# Altium project LimeSDR-QPCIe_1v2.PrjPcb (part 3 of 13)

## Sheet 09_RF_Loopback.SchDoc: Loopback
size A3; Organization: Lime Microsystems; Address1: Surrey Tech Centre; Address2: Guildford GU2 7YG; Address3: Surrey; Address4: United Kingdom; Revision: v1.2; SheetNumber: 9; SheetTotal: 27
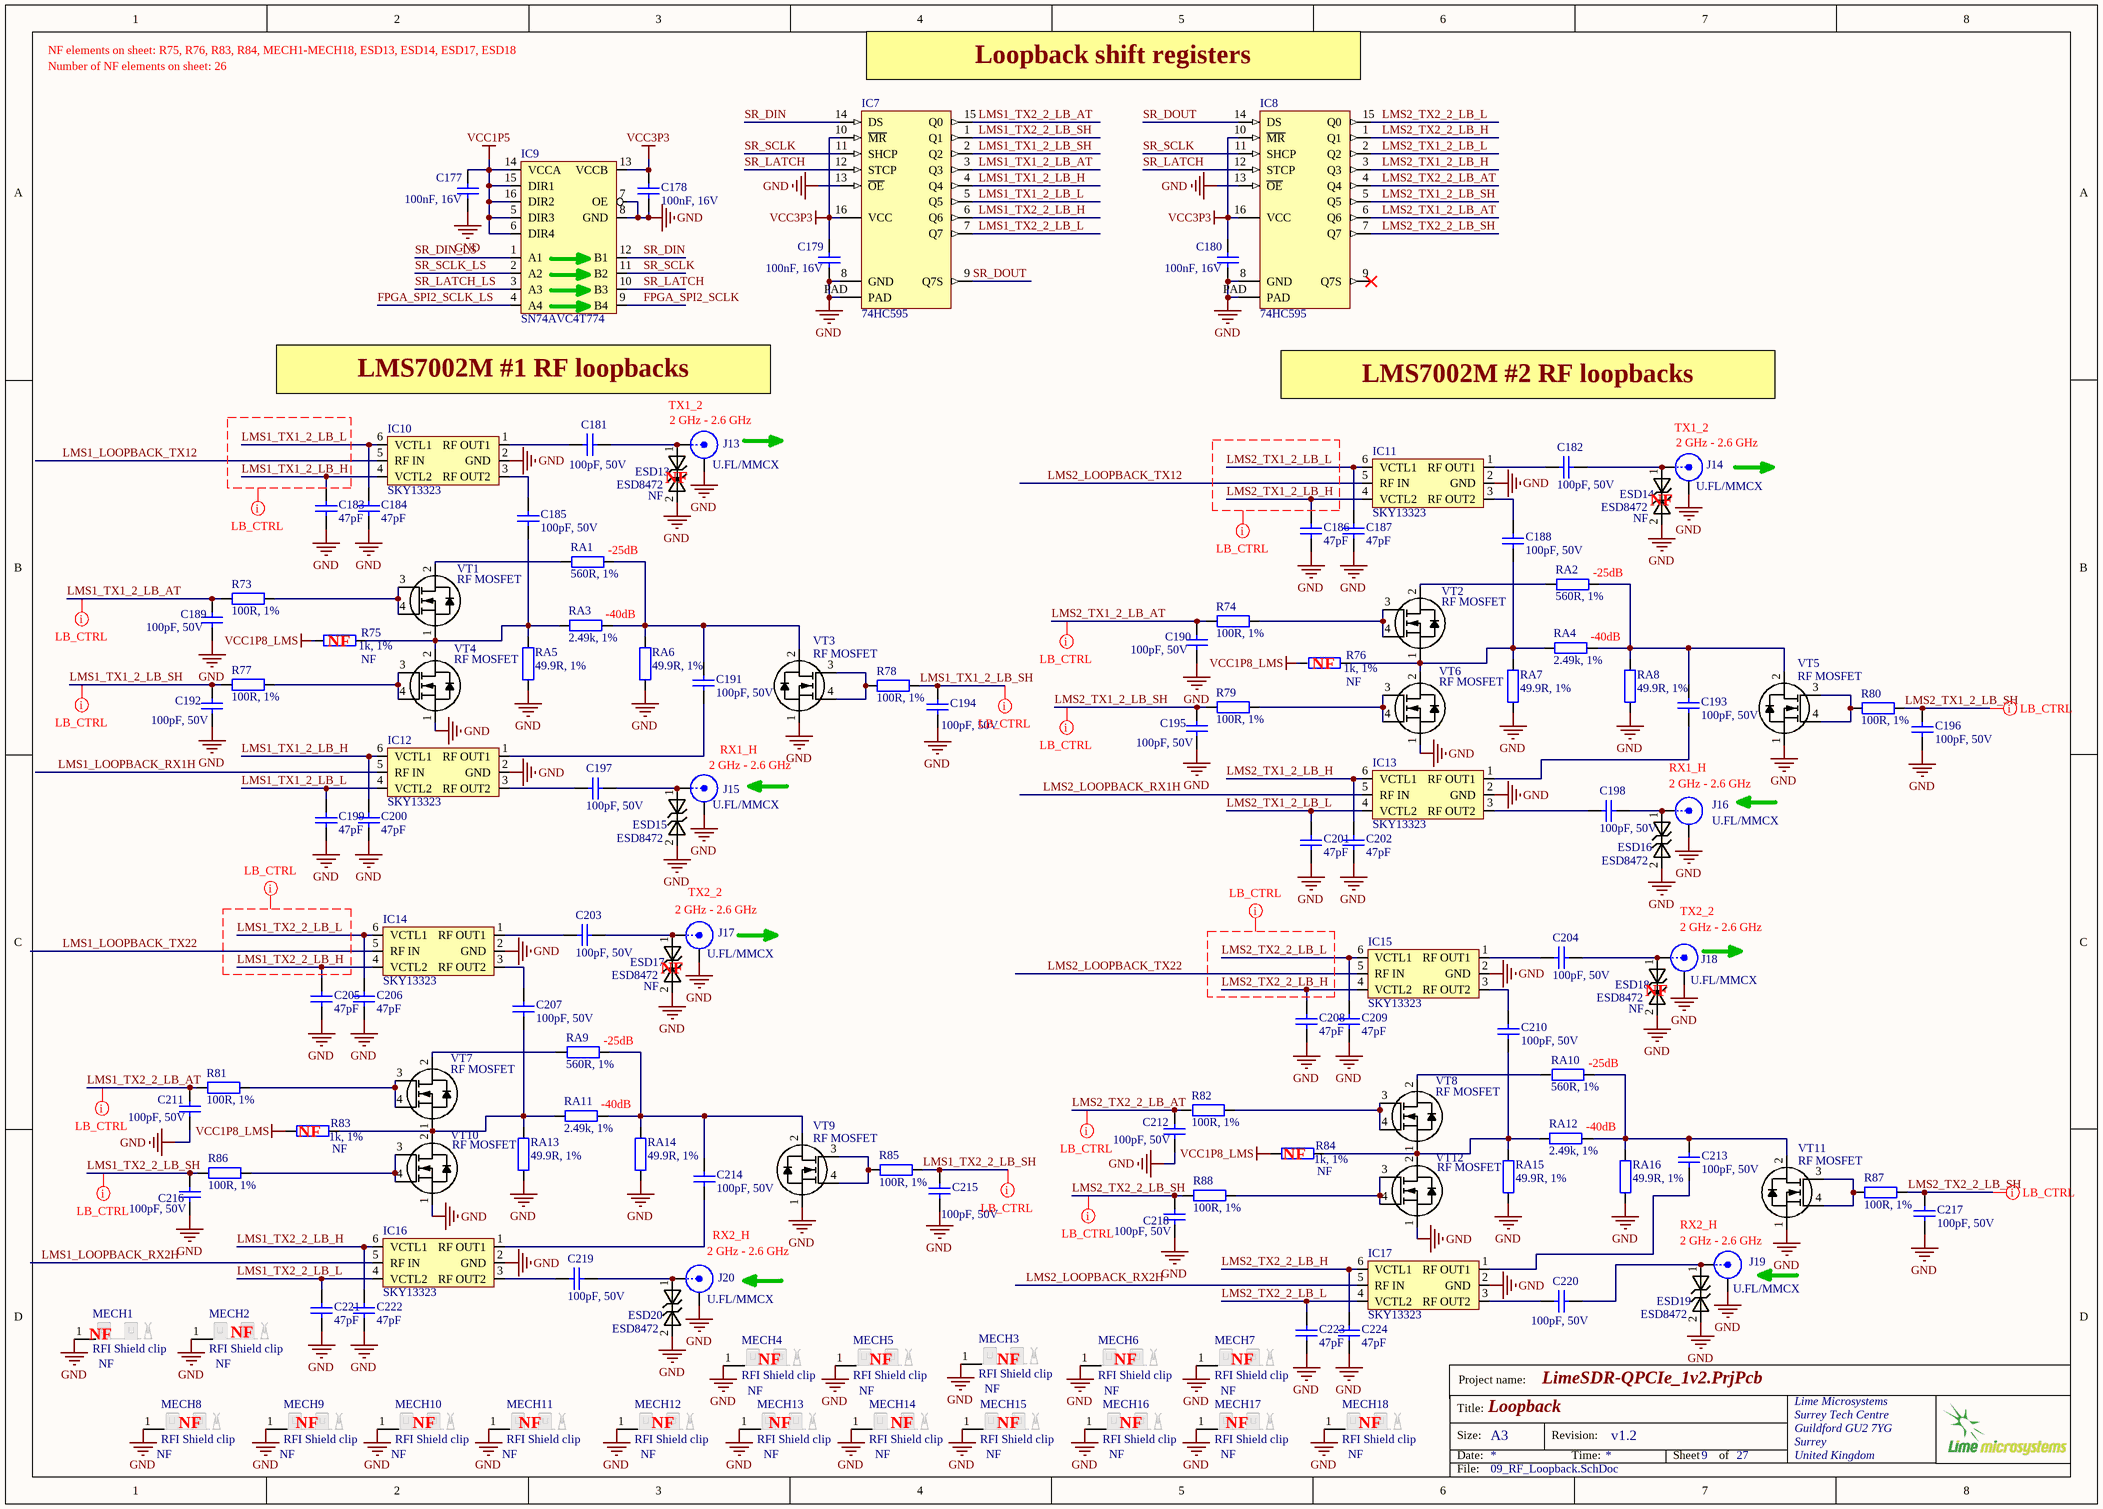
[diagram p8: 09_RF_Loopback.SchDoc]

### Parts
C177  100nF, 16V  [CAP0402]
C178  100nF, 16V  [CAP0402]
C179  100nF, 16V  [CAP0402]
C180  100nF, 16V  [CAP0402]
C181  100pF, 50V  [CAP0402]
C182  100pF, 50V  [CAP0402]
C183  47pF  [CAP0402]
C184  47pF  [CAP0402]
C185  100pF, 50V  [CAP0402]
C186  47pF  [CAP0402]
C187  47pF  [CAP0402]
C188  100pF, 50V  [CAP0402]
C189  100pF, 50V  [CAP0402]
C190  100pF, 50V  [CAP0402]
C191  100pF, 50V  [CAP0402]
C192  100pF, 50V  [CAP0402]
C193  100pF, 50V  [CAP0402]
C194  100pF, 50V  [CAP0402]
C195  100pF, 50V  [CAP0402]
C196  100pF, 50V  [CAP0402]
C197  100pF, 50V  [CAP0402]
C198  100pF, 50V  [CAP0402]
C199  47pF  [CAP0402]
C200  47pF  [CAP0402]
C201  47pF  [CAP0402]
C202  47pF  [CAP0402]
C203  100pF, 50V  [CAP0402]
C204  100pF, 50V  [CAP0402]
C205  47pF  [CAP0402]
C206  47pF  [CAP0402]
C207  100pF, 50V  [CAP0402]
C208  47pF  [CAP0402]
C209  47pF  [CAP0402]
C210  100pF, 50V  [CAP0402]
C211  100pF, 50V  [CAP0402]
C212  100pF, 50V  [CAP0402]
C213  100pF, 50V  [CAP0402]
C214  100pF, 50V  [CAP0402]
C215  100pF, 50V  [CAP0402]
C216  100pF, 50V  [CAP0402]
C217  100pF, 50V  [CAP0402]
C218  100pF, 50V  [CAP0402]
C219  100pF, 50V  [CAP0402]
C220  100pF, 50V  [CAP0402]
C221  47pF  [CAP0402]
C222  47pF  [CAP0402]
C223  47pF  [CAP0402]
C224  47pF  [CAP0402]
ESD13  ESD8472  Assembly Info: NF  [ESD8472_X3DFN2]
ESD14  ESD8472  Assembly Info: NF  [ESD8472_X3DFN2]
ESD15  ESD8472  [ESD8472_X3DFN2]
ESD16  ESD8472  [ESD8472_X3DFN2]
ESD17  ESD8472  Assembly Info: NF  [ESD8472_X3DFN2]
ESD18  ESD8472  Assembly Info: NF  [ESD8472_X3DFN2]
ESD19  ESD8472  [ESD8472_X3DFN2]
ESD20  ESD8472  [ESD8472_X3DFN2]
IC7  74HC595  [74HC595BQ,115]
IC8  74HC595  [74HC595BQ,115]
IC9  SN74AVC4T774  [SN74AVC4T774]
IC10  SKY13323  [SKY13323-378LF]
IC11  SKY13323  [SKY13323-378LF]
IC12  SKY13323  [SKY13323-378LF]
IC13  SKY13323  [SKY13323-378LF]
IC14  SKY13323  [SKY13323-378LF]
IC15  SKY13323  [SKY13323-378LF]
IC16  SKY13323  [SKY13323-378LF]
IC17  SKY13323  [SKY13323-378LF]
J13  U.FL/MMCX  [MMCX_UFL_conn_u]
J14  U.FL/MMCX  [MMCX_UFL_conn_u]
J15  U.FL/MMCX  [MMCX_UFL_conn_u]
J16  U.FL/MMCX  [MMCX_UFL_conn_u]
J17  U.FL/MMCX  [MMCX_UFL_conn_u]
J18  U.FL/MMCX  [MMCX_UFL_conn_u]
J19  U.FL/MMCX  [MMCX_UFL_conn_u]
J20  U.FL/MMCX  [MMCX_UFL_conn_u]
MECH1  RFI Shield clip  Assembly Info: NF  [RFI_SHIELD_CLPS_MINI]
MECH2  RFI Shield clip  Assembly Info: NF  [RFI_SHIELD_CLPS_MINI]
MECH3  RFI Shield clip  Assembly Info: NF  [RFI_SHIELD_CLPS_MINI]
MECH4  RFI Shield clip  Assembly Info: NF  [RFI_SHIELD_CLPS_MINI]
MECH5  RFI Shield clip  Assembly Info: NF  [RFI_SHIELD_CLPS_MINI]
MECH6  RFI Shield clip  Assembly Info: NF  [RFI_SHIELD_CLPS_MINI]
MECH7  RFI Shield clip  Assembly Info: NF  [RFI_SHIELD_CLPS_MINI]
MECH8  RFI Shield clip  Assembly Info: NF  [RFI_SHIELD_CLPS_MINI]
MECH9  RFI Shield clip  Assembly Info: NF  [RFI_SHIELD_CLPS_MINI]
MECH10  RFI Shield clip  Assembly Info: NF  [RFI_SHIELD_CLPS_MINI]
MECH11  RFI Shield clip  Assembly Info: NF  [RFI_SHIELD_CLPS_MINI]
MECH12  RFI Shield clip  Assembly Info: NF  [RFI_SHIELD_CLPS_MINI]
MECH13  RFI Shield clip  Assembly Info: NF  [RFI_SHIELD_CLPS_MINI]
MECH14  RFI Shield clip  Assembly Info: NF  [RFI_SHIELD_CLPS_MINI]
MECH15  RFI Shield clip  Assembly Info: NF  [RFI_SHIELD_CLPS_MINI]
MECH16  RFI Shield clip  Assembly Info: NF  [RFI_SHIELD_CLPS_MINI]
MECH17  RFI Shield clip  Assembly Info: NF  [RFI_SHIELD_CLPS_MINI]
MECH18  RFI Shield clip  Assembly Info: NF  [RFI_SHIELD_CLPS_MINI]
R73  100R, 1%  [RES0402]
R74  100R, 1%  [RES0402]
R75  1k, 1%  Assembly Info: NF  [RES0402]
R76  1k, 1%  Assembly Info: NF  [RES0402]
R77  100R, 1%  [RES0402]
R78  100R, 1%  [RES0402]
R79  100R, 1%  [RES0402]
R80  100R, 1%  [RES0402]
R81  100R, 1%  [RES0402]
R82  100R, 1%  [RES0402]
R83  1k, 1%  Assembly Info: NF  [RES0402]
R84  1k, 1%  Assembly Info: NF  [RES0402]
R85  100R, 1%  [RES0402]
R86  100R, 1%  [RES0402]
R87  100R, 1%  [RES0402]
R88  100R, 1%  [RES0402]
RA1  560R, 1%  [RES0402]
RA2  560R, 1%  [RES0402]
RA3  2.49k, 1%  [RES0402]
RA4  2.49k, 1%  [RES0402]
RA5  49.9R, 1%  [RES0402]
RA6  49.9R, 1%  [RES0402]
RA7  49.9R, 1%  [RES0402]
RA8  49.9R, 1%  [RES0402]
RA9  560R, 1%  [RES0402]
RA10  560R, 1%  [RES0402]
RA11  2.49k, 1%  [RES0402]
RA12  2.49k, 1%  [RES0402]
RA13  49.9R, 1%  [RES0402]
RA14  49.9R, 1%  [RES0402]
RA15  49.9R, 1%  [RES0402]
RA16  49.9R, 1%  [RES0402]
VT1  RF MOSFET  [BF1105R_SOT143R4]
VT2  RF MOSFET  [BF1105R_SOT143R4]
VT3  RF MOSFET  [BF1105R_SOT143R4]
VT4  RF MOSFET  [BF1105R_SOT143R4]
VT5  RF MOSFET  [BF1105R_SOT143R4]
VT6  RF MOSFET  [BF1105R_SOT143R4]
VT7  RF MOSFET  [BF1105R_SOT143R4]
VT8  RF MOSFET  [BF1105R_SOT143R4]
VT9  RF MOSFET  [BF1105R_SOT143R4]
VT10  RF MOSFET  [BF1105R_SOT143R4]
VT11  RF MOSFET  [BF1105R_SOT143R4]
VT12  RF MOSFET  [BF1105R_SOT143R4]

### Nets
GND: C177.1 C178.1 C179.1 C180.1 C183.1 C184.1 C186.1 C187.1 C189.2 C190.2 C192.2 C194.2 C195.2 C196.2 C199.1 C200.1 C201.1 C202.1 C205.1 C206.1 C208.1 C209.1 C211.2 C212.2 C215.2 C216.2 C217.2 C218.2 C221.1 C222.1 C223.1 C224.1 ESD13.2 ESD14.2 ESD15.2 ESD16.2 ESD17.2 ESD18.2 ESD19.2 ESD20.2 IC7.8(GND) IC7.13(~{OE}) IC7.PAD IC8.8(GND) IC8.13(~{OE}) IC8.PAD IC9.7(OE) IC9.8(GND) IC10.2(GND) IC11.2(GND) IC12.2(GND) IC13.2(GND) IC14.2(GND) IC15.2(GND) IC16.2(GND) IC17.2(GND) J13.2(Y) J14.2(Y) J15.2(Y) J16.2(Y) J17.2(Y) J18.2(Y) J19.2(Y) J20.2(Y) MECH1.1(GND) MECH2.1(GND) MECH3.1(GND) MECH4.1(GND) MECH5.1(GND) MECH6.1(GND) MECH7.1(GND) MECH8.1(GND) MECH9.1(GND) MECH10.1(GND) MECH11.1(GND) MECH12.1(GND) MECH13.1(GND) MECH14.1(GND) MECH15.1(GND) MECH16.1(GND) MECH17.1(GND) MECH18.1(GND) RA5.1 RA6.1 RA7.1 RA8.1 RA13.1 RA14.1 RA15.1 RA16.1 VT3.1(S) VT4.1(S) VT5.1(S) VT6.1(S) VT9.1(S) VT10.1(S) VT11.1(S) VT12.1(S)
VCC1P5: C177.2 IC9.5(DIR3) IC9.6(DIR4) IC9.14(VCCA) IC9.15(DIR1) IC9.16(DIR2)
VCC1P8_LMS: R75.2 R76.2 R83.2 R84.2
VCC3P3: C178.2 C179.2 C180.2 IC7.10(~{MR}) IC7.16(VCC) IC8.10(~{MR}) IC8.16(VCC) IC9.13(VCCB)
FPGA_SPI2_SCLK: IC9.9(B4)
FPGA_SPI2_SCLK_LS: IC9.4(A4)
LMS1_LOOPBACK_RX1H: IC12.5(RF_IN)
LMS1_LOOPBACK_RX2H: IC16.5(RF_IN)
LMS1_LOOPBACK_TX12: IC10.5(RF_IN)
LMS1_LOOPBACK_TX22: IC14.5(RF_IN)
LMS1_TX1_2_LB_AT: C189.1 IC7.3(Q3) R73.2
LMS1_TX1_2_LB_H: C183.2 C200.2 IC7.4(Q4) IC10.4(VCTL2) IC12.6(VCTL1)
LMS1_TX1_2_LB_L: C184.2 C199.2 IC7.5(Q5) IC10.6(VCTL1) IC12.4(VCTL2)
LMS1_TX1_2_LB_SH: C192.1 C194.1 IC7.2(Q2) R77.2 R78.1
LMS1_TX2_2_LB_AT: C211.1 IC7.15(Q0) R81.2
LMS1_TX2_2_LB_H: C205.2 C222.2 IC7.6(Q6) IC14.4(VCTL2) IC16.6(VCTL1)
LMS1_TX2_2_LB_L: C206.2 C221.2 IC7.7(Q7) IC14.6(VCTL1) IC16.4(VCTL2)
LMS1_TX2_2_LB_SH: C215.1 C216.1 IC7.1(Q1) R85.1 R86.2
LMS2_LOOPBACK_RX1H: IC13.5(RF_IN)
LMS2_LOOPBACK_RX2H: IC17.5(RF_IN)
LMS2_LOOPBACK_TX12: IC11.5(RF_IN)
LMS2_LOOPBACK_TX22: IC15.5(RF_IN)
LMS2_TX1_2_LB_AT: C190.1 IC8.6(Q6) R74.2
LMS2_TX1_2_LB_H: C186.2 C202.2 IC8.3(Q3) IC11.4(VCTL2) IC13.6(VCTL1)
LMS2_TX1_2_LB_L: C187.2 C201.2 IC8.2(Q2) IC11.6(VCTL1) IC13.4(VCTL2)
LMS2_TX1_2_LB_SH: C195.1 C196.1 IC8.5(Q5) R79.2 R80.1
LMS2_TX2_2_LB_AT: C212.1 IC8.4(Q4) R82.2
LMS2_TX2_2_LB_H: C208.2 C224.2 IC8.1(Q1) IC15.4(VCTL2) IC17.6(VCTL1)
LMS2_TX2_2_LB_L: C209.2 C223.2 IC8.15(Q0) IC15.6(VCTL1) IC17.4(VCTL2)
LMS2_TX2_2_LB_SH: C217.1 C218.1 IC8.7(Q7) R87.1 R88.2
SR_DIN: IC7.14(DS) IC9.12(B1)
SR_DIN_LS: IC9.1(A1)
SR_DOUT: IC7.9(Q7S) IC8.14(DS)
SR_LATCH: IC7.12(STCP) IC8.12(STCP) IC9.10(B3)
SR_LATCH_LS: IC9.3(A3)
SR_SCLK: IC7.11(SHCP) IC8.11(SHCP) IC9.11(B2)
SR_SCLK_LS: IC9.2(A2)
NetC181_1: C181.1 ESD13.1 J13.1(X)
NetC181_2: C181.2 IC10.1(RF_OUT1)
NetC182_1: C182.1 ESD14.1 J14.1(X)
NetC182_2: C182.2 IC11.1(RF_OUT1)
NetC185_1: C185.1 IC10.3(RF_OUT2)
NetC185_2: C185.2 R75.1 RA3.1 RA5.2 VT1.1(S) VT4.2(D)
NetC188_1: C188.1 IC11.3(RF_OUT2)
NetC188_2: C188.2 R76.1 RA4.1 RA7.2 VT2.1(S) VT6.2(D)
NetC191_1: C191.1 RA1.1 RA3.2 RA6.2 VT3.2(D)
NetC191_2: C191.2 IC12.1(RF_OUT1)
NetC193_1: C193.1 RA2.1 RA4.2 RA8.2 VT5.2(D)
NetC193_2: C193.2 IC13.1(RF_OUT1)
NetC197_1: C197.1 ESD15.1 J15.1(X)
NetC197_2: C197.2 IC12.3(RF_OUT2)
NetC198_1: C198.1 ESD16.1 J16.1(X)
NetC198_2: C198.2 IC13.3(RF_OUT2)
NetC203_1: C203.1 ESD17.1 J17.1(X)
NetC203_2: C203.2 IC14.1(RF_OUT1)
NetC204_1: C204.1 ESD18.1 J18.1(X)
NetC204_2: C204.2 IC15.1(RF_OUT1)
NetC207_1: C207.1 IC14.3(RF_OUT2)
NetC207_2: C207.2 R83.1 RA11.1 RA13.2 VT7.1(S) VT10.2(D)
NetC210_1: C210.1 IC15.3(RF_OUT2)
NetC210_2: C210.2 R84.1 RA12.1 RA15.2 VT8.1(S) VT12.2(D)
NetC213_1: C213.1 RA10.1 RA12.2 RA16.2 VT11.2(D)
NetC213_2: C213.2 IC17.1(RF_OUT1)
NetC214_1: C214.1 RA9.1 RA11.2 RA14.2 VT9.2(D)
NetC214_2: C214.2 IC16.1(RF_OUT1)
NetC219_1: C219.1 ESD20.1 J20.1(X)
NetC219_2: C219.2 IC16.3(RF_OUT2)
NetC220_1: C220.1 ESD19.1 J19.1(X)
NetC220_2: C220.2 IC17.3(RF_OUT2)
NetR73_1: R73.1 VT1.3(G2) VT1.4(G1)
NetR74_1: R74.1 VT2.3(G2) VT2.4(G1)
NetR77_1: R77.1 VT4.3(G2) VT4.4(G1)
NetR78_2: R78.2 VT3.3(G2) VT3.4(G1)
NetR79_1: R79.1 VT6.3(G2) VT6.4(G1)
NetR80_2: R80.2 VT5.3(G2) VT5.4(G1)
NetR81_1: R81.1 VT7.3(G2) VT7.4(G1)
NetR82_1: R82.1 VT8.3(G2) VT8.4(G1)
NetR85_2: R85.2 VT9.3(G2) VT9.4(G1)
NetR86_1: R86.1 VT10.3(G2) VT10.4(G1)
NetR87_2: R87.2 VT11.3(G2) VT11.4(G1)
NetR88_1: R88.1 VT12.3(G2) VT12.4(G1)
NetRA1_2: RA1.2 VT1.2(D)
NetRA2_2: RA2.2 VT2.2(D)
NetRA9_2: RA9.2 VT7.2(D)
NetRA10_2: RA10.2 VT8.2(D)

Not connected (* = marked no-connect by the designer): IC8 9(Q7S)*

### Layout directives
net class LB_CTRL: LMS1_TX1_2_LB_AT, LMS1_TX1_2_LB_H, LMS1_TX1_2_LB_L, LMS1_TX1_2_LB_SH, LMS1_TX2_2_LB_AT, LMS1_TX2_2_LB_H, LMS1_TX2_2_LB_L, LMS1_TX2_2_LB_SH, LMS2_TX1_2_LB_AT, LMS2_TX1_2_LB_H, LMS2_TX1_2_LB_L, LMS2_TX1_2_LB_SH, LMS2_TX2_2_LB_AT, LMS2_TX2_2_LB_H, LMS2_TX2_2_LB_L, LMS2_TX2_2_LB_SH

### Notes on the sheet
- NF elements on sheet: R75, R76, R83, R84, MECH1-MECH18, ESD13, ESD14, ESD17, ESD18
- Number of NF elements on sheet: 26
- Loopback shift registers
- LMS7002M #1 RF loopbacks
- TX1_2
- 2 GHz - 2.6 GHz
- LMS7002M #2 RF loopbacks
- (near J14) 2 GHz - 2.6 GHz
- (near ESD13) NF
- (near ESD14) NF
- (near RA1) -25dB
- (near RA2) -25dB
- (near R75) NF
- (near RA3) -40dB
- (near RA4) -40dB
- (near R76) NF
- (near J15) 2 GHz - 2.6 GHz
- RX1_H
- TX2_2
- (near ESD17) NF
- (near J18) 2 GHz - 2.6 GHz
- (near RA9) -25dB
- (near ESD18) NF
- (near RA11) -40dB
- (near RA10) -25dB
- (near R83) NF
- (near R84) NF
- (near RA12) -40dB
- (near J20) 2 GHz - 2.6 GHz
- RX2_H
- (near MECH1) NF
- (near MECH2) NF
- (near MECH4) NF
- (near MECH5) NF
- (near MECH3) NF
- (near MECH6) NF
- (near MECH7) NF
- (near MECH8) NF
- (near MECH9) NF
- (near MECH10) NF
- (near MECH11) NF
- (near MECH12) NF
- (near MECH13) NF
- (near MECH14) NF
- (near MECH15) NF
- (near MECH16) NF
- (near MECH17) NF
- (near MECH18) NF
- Project name:
- Title:
- Size:
- Date:
- A3
- Revision:
- Time:
- Sheet
- of
- File:

### Library data of the parts
C177-C180 = Cap_0402: Manufacturer: Murata Electronics; Manufacturer Part Number: GRM155R71C104KA88D; Part Description: 0.10µF ±10% 16V Ceramic Capacitor X7R 0402 (1005 Metric); Tolerance: 10 %; Type: General Purpose MLCC; Capacitance: 0.1 uF; Case Length: 1 mm; Dielectric: X7R; Case Height: 0.5 mm; Temperature Coefficient / Code: +/- 15 %; Value: 100nF, 16V; Supplier 1: Mouser; Supplier Part Number 1: 81-GRM155R71C104KA88; Case Code - in: 0402; RoHS: RoHS Compliant; Operating Temperature Range: - 55 C to + 125 C; Series: GRM; Termination Style: SMD/SMT; Package / Case: 0402 (1005 metric); Voltage Rating DC: 16 V; Maximum Operating Temperature: + 125 C; Case Code - mm: 1005; Minimum Operating Temperature: - 55 C; Product Category: Low & Medium Capacitance SMD Ceramic Chip Capacitors; Packaging: Reel; Product: General Type MLCCs; Category: Multilayer Ceramic Capacitors MLCC - SMD/SMT; Brand: Murata Electronics; Case Width: 0.5 mm; RoHS - Mouser: Y; Standard Pack Qty: 10000; Minimum Order Quantity: 1; Reeling: True; Manufacturer Part Number 1: GRM155R71C104KA88D
C181 C182 C185 C188-C198 C203 C204 C207 C210-C220 = Cap_0402: Manufacturer Part Number 1: CC0402JRNPO9BN101; Manufacturer: Yageo; Part Description: 100pF ±5% 50V C0G, NP0 Ceramic Capacitor -55°C ~ 125°C Surface Mount, MLCC 0402 (1005 Metric) 0.039" L x 0.020" W (1.00mm x 0.50mm); Tolerance: ±5%; Temperature Coefficient: C0G, NP0; Value: 100pF, 50V; Capacitance: 100pF; Thickness (Max): 0.022" (0.55mm); Size / Dimension: 0.039" L x 0.020" W (1.00mm x 0.50mm); RoHS: RoHS Compliant; Ratings: -; Package / Case: 0402 (1005 Metric); Mounting Type: Surface Mount, MLCC; Height - Seated (Max): -; Features: -; Lead Spacing: -; Voltage - Rated: 50V; Operating Temperature: -55°C ~ 125°C; Packaging: Cut Tape (CT); Applications: General Purpose; Lead Style: -; Supplier 1: Digi-Key; Category: Capacitors; Supplier Part Number 1: 311-1024-1-ND
C183 C184 C186 C187 C199-C202 C205 C206 C208 C209 C221-C224 = Cap_0402: Manufacturer Part Number 1: C1005C0G1H470F050BA; Manufacturer: TDK Corporation; Part Description: 47pF ±1% 50V C0G, NP0 Ceramic Capacitor -55°C ~ 125°C Surface Mount, MLCC 0402 (1005 Metric) 0.039" L x 0.020" W (1.00mm x 0.50mm); Voltage - Rated: 50V; Temperature Coefficient: C0G, NP0; Tolerance: ±1%; Value: 47pF; Supplier 1: Digi-Key; Supplier Part Number 1: 445-5361-1-ND; Package / Case: 0402 (1005 Metric); Lead Spacing: -; Ratings: -; Mounting Type: Surface Mount, MLCC; Operating Temperature: -55°C ~ 125°C; Thickness (Max): 0.022" (0.55mm); Capacitance: 47pF; Packaging: Cut Tape (CT); Features: -; Applications: General Purpose; Lead Style: -; Size / Dimension: 0.039" L x 0.020" W (1.00mm x 0.50mm); Height - Seated (Max): -; RoHS: RoHS Compliant; Category: Capacitors
ESD13-ESD20 = ESD8472: Manufacturer: ON Semiconductor; Manufacturer Part Number: ESD8472MUT5G; Part Description: TVS DIODE 5.3VWM 14VC X3DFN2; Voltage - Reverse Standoff (Typ): 5.3V (Max); Voltage - Breakdown (Min): 7V; Voltage - Clamping (Max) @ Ipp: 14V; Current - Peak Pulse (10/1000µs): 3A (8/20µs); Power Line Protection: No; Capacitance @ Frequency: 0.2pF @ 1MHz; Supplier 1: Digi-Key; RoHS: RoHS Compliant; Category: Circuit Protection; Stock 1: 2295; Pricing 1: 1=0.39, 10=0.315, 100=0.2142, 500=0.16068, 1000=0.12051 (USD); Packaging: Cut Tape (CT); Part Status: Active; Type: Zener; Power - Peak Pulse: -; Applications: Automotive, RF Antenna; Operating Temperature: -55°C ~ 150°C (TJ); Mounting Type: Surface Mount; Package / Case: 2-XFDFN; Supplier Device Package: 2-X3DFN (0.62x0.32); ComponentLink1URL: http://www.onsemi.com/pub/Collateral/ESD8472-D.PDF; ComponentLink1Description: http://www.onsemi.com/pub/Collateral/ESD8472-D.PDF; Supplier Part Number 1: ESD8472MUT5GOSCT-ND
IC7 IC8 = 74HC595BQ,115: Part Description: C 8BIT SHIFT REGISTER 16-DHVQFN; Manufacturer: Nexperia USA Inc.; Logic Type: Shift Register; Output Type: Tri-State; Number of Bits per Element: 8; Function: Serial to Parallel, Serial; Voltage - Supply: 2 V ~ 6 V; Supplier 1: Digi-Key; Manufacturer Part Number 1: 74HC595BQ,115; RoHS: RoHS Compliant; Category: Integrated Circuits (ICs); Stock 1: 15449; Pricing 1: 1=0.39, 10=0.32, 100=0.2175, 500=0.16316, 1000=0.12236 (USD); Packaging: Cut Tape (CT); Part Status: Active; Operating Temperature: -40°C ~ 125°C; Mounting Type: Surface Mount; Package / Case: 16-VFQFN Exposed Pad; Supplier Device Package: 16-DHVQFN (2.5x3.5); ComponentLink1URL: http://assets.nexperia.com/documents/data-sheet/74HC_HCT595.pdf; ComponentLink1Description: http://assets.nexperia.com/documents/data-sheet/74HC_HCT595.pdf; Supplier Part Number 1: 1727-3327-1-ND
IC9 = SN74AVC4T774: Manufacturer: Texas Instruments; Manufacturer Part Number 1: SN74AVC4T774RSVR; Part Description: Voltage Level Translator Bidirectional 1 Circuit 4 Channel 380Mbps 16-UQFN (2.6x1.8); Logic Function: Translator, Bidirectional, 3-State; Differential - Input:Output: No/No; Propagation Delay (Max): 2.4ns; Number of Bits: 4; Number of Outputs/Channel: 1; Input Type: Logic; Voltage - Supply: 1.2 V ~ 3.6 V; Data Rate: 380Mbps; Supplier 1: Digi-Key; Supplier Device Package: 16-UQFN (2.6x1.8); Packaging: Digi-Reel®; Category: Integrated Circuits (ICs); Mounting Type: Surface Mount; RoHS: RoHS Compliant; Number of Channels: 4; Output Type: Logic; Package / Case: 16-UFQFN; Operating Temperature: -40°C ~ 85°C; Supplier Part Number 1: 296-24741-6-ND
IC10-IC17 = SKY13323: SKY13323-378LF: 0.1-3.0 GHz GaAs SPDT Switch; Manufacturer: Skyworks Solutions Inc.; Part Description: IC SPDT 100MHZ-3GHZ 6-MLPD; Frequency - Lower: 100MHz; P1dB: 27dBm (typ) IP1dB; Isolation @ Frequency: 27dB @ 3GHz (typ); RF Type: 802.11b/g; Impedance: 50 Ohm; IIP3: 50dBm (typ); Topology: Reflective; Insertion Loss @ Frequency: 0.35dB @ 3GHz; Frequency - Upper: 3GHz; Supplier 1: Digi-Key; Operating Temperature: -40°C ~ 85°C; RoHS: RoHS Compliant; Package / Case: 6-XFDFN Exposed Pad; Circuit: SPDT; Features: -; Supplier Device Package: 6-MLPD (1x1); Category: RF/IF and RFID; Packaging: Cut Tape (CT); Manufacturer Part Number 1: SKY13323-378LF; Supplier Part Number 1: 683-1334-1-ND
J13-J20 = RF_IF_connector: CONN UMC RCPT STR 50 OHM SMD; Manufacturer: Molex, LLC; Manufacturer Part Number 1: 0734120110; Part Description: Ultra Miniature Coaxial Connector Receptacle, Male Pin 50 Ohm Surface Mount Solder; Body Finish: Nickel; Body Material: Phosphor Bronze; Center Contact Material: Brass; Center Contact Plating: Gold; Connector Style: Ultra Miniature Coaxial; Connector Type: Jack, Male Pin; Contact Termination: Solder; Dielectric Material: Liquid Crystal Polymer (LCP); Frequency - Max: 6GHz; Impedance: 50 Ohm; Voltage Rating: 60V; Cable Group: -; Category: Connectors, Interconnects; Fastening Type: Snap-On; Features: -; Housing Color: Silver; Ingress Protection: -; Mounting Type: Surface Mount; Operating Temperature: -40°C ~ 90°C; Packaging: Cut Tape (CT); RoHS: RoHS Compliant; Shield Termination: Solder; Supplier 1: Digi-Key; Supplier Part Number 1: WM5587CT-ND
MECH1-MECH18 = RFI_SHIELD_CLIP: Manufacturer: HARWIN; Part Description: RFI SHIELD CLIP MINI TIN SMD; Manufacturer Part Number 1: S0971-46R; SVHC: No SVHC (15-Jun-2015); Supplier 1: Farnell; Supplier: Farnell; Length: 5.8; Clip Type: RFI Shield Clip; Clip Diameter: -; Product Range: -; Mounting Hole Dia: -; RoHS: YES; Supplier Part Number 1: 2361677
R73 R74 R77-R82 R85-R88 = Res_0402: Manufacturer Part Number 1: RMCF0402FT100R; Part Description: RES SMD 100 OHM 1% 1/16W 0402; Manufacturer: Stackpole Electronics Inc.; Temperature Coefficient: ±100ppm/°C; Supplier 1: Digi-Key; Supplier Part Number 1: RMCF0402FT100RDKR-ND; Package / Case: 0402 (1005 Metric); Composition: Thick Film; Category: Resistors; Tolerance: ±1%; Value: 100R, 1%
R75 R76 R83 R84 = Res_0402: Manufacturer: Stackpole Electronics Inc; Manufacturer Part Number 1: RMCF0402FT1K00; Part Description: RES SMD 1K OHM 1% 1/16W 0402; Temperature Coefficient: ±100ppm/°C; Power (Watts): 0.063W, 1/16W; Value: 1k, 1%; Supplier 1: Digi-Key; Supplier Part Number 1: RMCF0402FT1K00TR-ND; Resistance (Ohms): 1k; Packaging: Tape & Reel (TR); Category: Resistors; RoHS: RoHS Compliant; Tolerance: ±1%; Height: 0.016" (0.40mm); Number of Terminations: 2; Package / Case: 0402 (1005 Metric); Operating Temperature: -55°C ~ 155°C; Features: -; Composition: Thick Film; Supplier Device Package: 0402; Size / Dimension: 0.039" L x 0.020" W (1.00mm x 0.50mm)
RA1 RA2 RA9 RA10 = Res_0402: Manufacturer Part Number: CRCW0402560RFKED; Manufacturer: Vishay Dale; Part Description: RES SMD 560 OHM 1% 1/16W 0402; Resistance (Ohms): 560; Power (Watts): 0.063W, 1/16W; Temperature Coefficient: ±100ppm/°C; RoHS: RoHS Compliant; Packaging: Cut Tape (CT); Composition: Thick Film; Tolerance: ±1%; Number of Terminations: 2; Supplier Device Package: 0402 (1005 Metric); Operating Temperature: -55°C ~ 155°C; Features: Automotive AEC-Q200; Category: Resistors; Supplier Part Number 1: 541-560LCT-ND; Package / Case: 0402 (1005 Metric); Supplier 1: Digi-Key; Height: 0.016" (0.40mm); Size / Dimension: 0.039" L x 0.020" W (1.00mm x 0.50mm)
RA3 RA4 RA11 RA12 = Res_0402: Manufacturer Part Number: RC0402FR-072K49L; Manufacturer: Yageo; Part Description: RES SMD 2.49K OHM 1% 1/16W 0402; Temperature Coefficient: ±100ppm/°C; Power (Watts): 0.063W, 1/16W; Value: 2.49k, 1%; Size / Dimension: 0.039" L x 0.020" W (1.00mm x 0.50mm); Height: 0.016" (0.40mm); Features: Moisture Resistant; Resistance (Ohms): 2.49k; Operating Temperature: -55°C ~ 155°C; Tolerance: ±1%; Composition: Thick Film; Supplier Device Package: 0402; Package / Case: 0402 (1005 Metric); Number of Terminations: 2; Category: Resistors; Packaging: Digi-Reel®; Supplier Part Number 1: 311-2.49KLRDKR-ND; RoHS: RoHS Compliant; Supplier 1: Digi-Key
RA5-RA8 RA13-RA16 = Res_0402: Manufacturer: Samsung Electro-Mechanics America, Inc.; Manufacturer Part Number: RC1005F49R9CS; Part Description: RES SMD 49.9 OHM 1% 1/16W 0402; Temperature Coefficient: ±100ppm/°C; Resistance (Ohms): 49.9; Power (Watts): 0.063W, 1/16W; Number of Terminations: 2; Size / Dimension: 0.039" L x 0.020" W (1.00mm x 0.50mm); Supplier Device Package: 0402 (1005 Metric); RoHS: RoHS Compliant; Supplier Part Number 1: 1276-3469-6-ND; Features: -; Packaging: Digi-Reel®; Tolerance: ±1%; Height: 0.016" (0.40mm); Category: Resistors; Composition: Thick Film; Package / Case: 0402 (1005 Metric); Supplier 1: Digi-Key; Operating Temperature: -55°C ~ 155°C; Value: 49.9R, 1%
VT1-VT12 = BF1105R,215: Manufacturer: NXP Semiconductors; Part Description: RF MOSFET Transistors Trans MOSFET N-CH 7V 0.03A 4pin(3+Tab); Voltage - Rated: 7V; Noise Figure: 1.7dB; Current Rating: 30mA; Gain: 20dB; Transistor Type: N-Channel Dual Gate; Frequency: 800MHz; Voltage - Test: 5V; Supplier 1: Digi-Key; RoHS: RoHS Compliant; Supplier Device Package: SOT-143R; Power - Output: -; Current - Test: -; Manufacturer Part Number 1: BF1105R,215; Packaging: Digi-Reel®; Package / Case: SOT-143R; Category: Discrete Semiconductor Products; Supplier Part Number 1: 568-12530-6-ND

## Sheet 10_RSSI1.SchDoc: RSSI1
size A3; Organization: Lime Microsystems; Address1: Surrey Tech Centre; Address2: Guildford GU2 7YG; Address3: Surrey; Address4: United Kingdom; Revision: v1.2; SheetNumber: 9; SheetTotal: 27
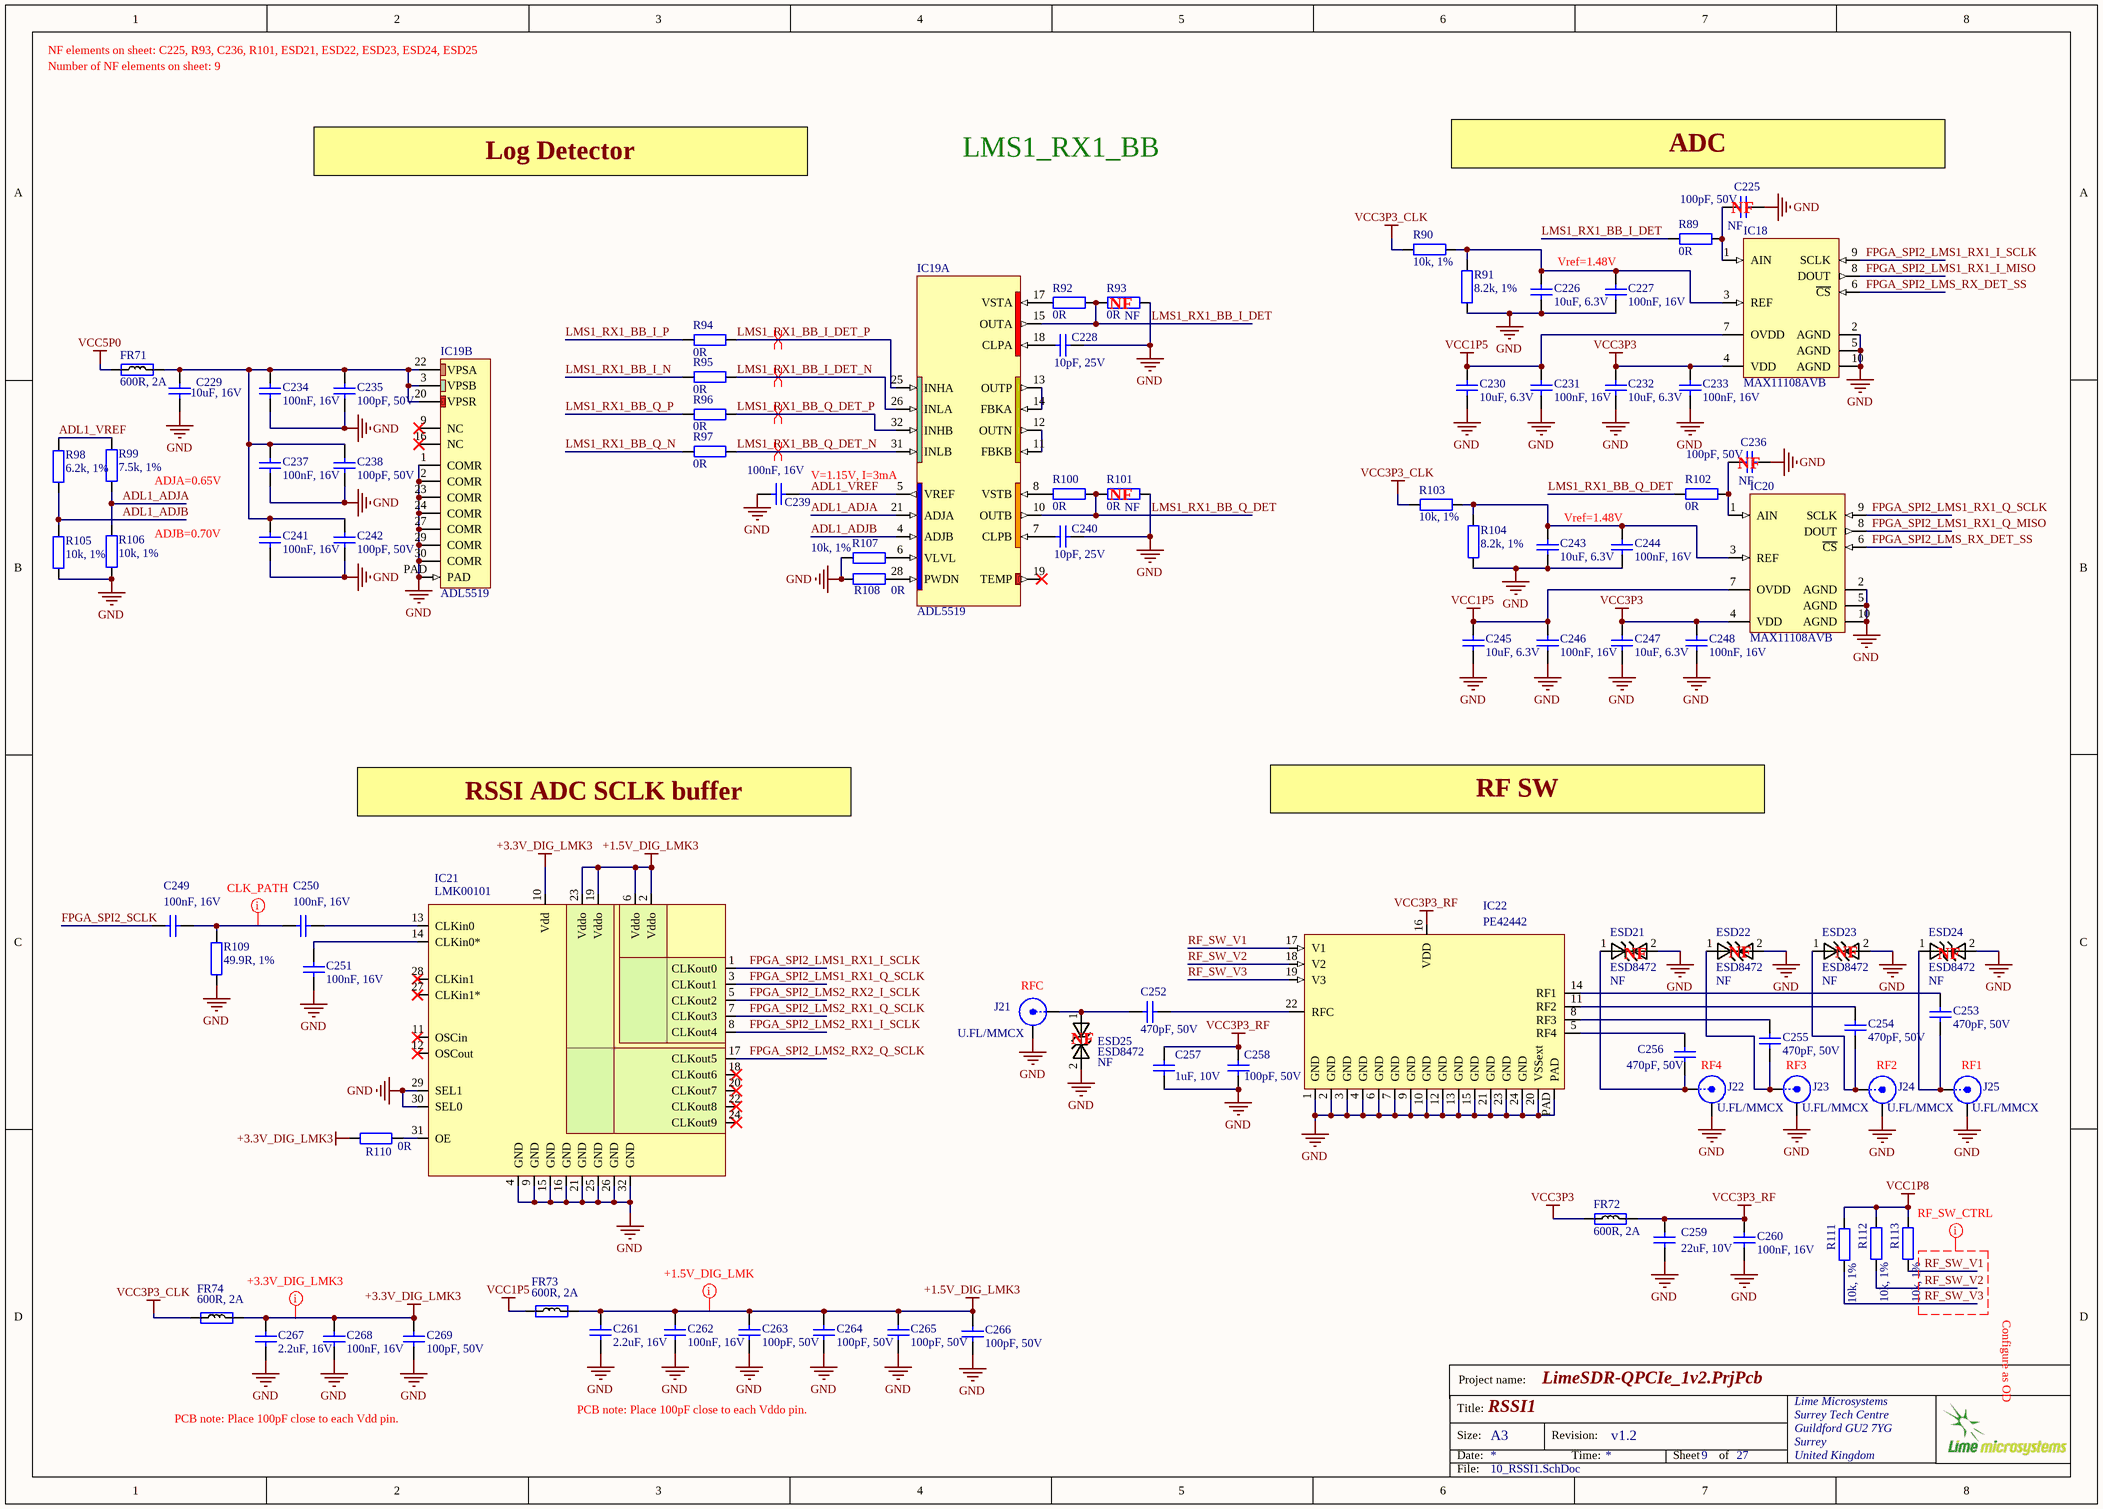
[diagram p9: 10_RSSI1.SchDoc]

### Parts
C225  100pF, 50V  Assembly Info: NF  [CAP0402]
C226  10uF, 6.3V  [CAP0603]
C227  100nF, 16V  [CAP0402]
C228  10pF, 25V  [CAP0402]
C229  10uF, 16V  [CAP0603]
C230  10uF, 6.3V  [CAP0603]
C231  100nF, 16V  [CAP0402]
C232  10uF, 6.3V  [CAP0603]
C233  100nF, 16V  [CAP0402]
C234  100nF, 16V  [CAP0402]
C235  100pF, 50V  [CAP0402]
C236  100pF, 50V  Assembly Info: NF  [CAP0402]
C237  100nF, 16V  [CAP0402]
C238  100pF, 50V  [CAP0402]
C239  100nF, 16V  [CAP0402]
C240  10pF, 25V  [CAP0402]
C241  100nF, 16V  [CAP0402]
C242  100pF, 50V  [CAP0402]
C243  10uF, 6.3V  [CAP0603]
C244  100nF, 16V  [CAP0402]
C245  10uF, 6.3V  [CAP0603]
C246  100nF, 16V  [CAP0402]
C247  10uF, 6.3V  [CAP0603]
C248  100nF, 16V  [CAP0402]
C249  100nF, 16V  [CAP0402]
C250  100nF, 16V  [CAP0402]
C251  100nF, 16V  [CAP0402]
C252  470pF, 50V  [CAP0402]
C253  470pF, 50V  [CAP0402]
C254  470pF, 50V  [CAP0402]
C255  470pF, 50V  [CAP0402]
C256  470pF, 50V  [CAP0402]
C257  1uF, 10V  [CAP0402]
C258  100pF, 50V  [CAP0402]
C259  22uF, 10V  [CAP0603]
C260  100nF, 16V  [CAP0402]
C261  2.2uF, 16V  [CAP0402]
C262  100nF, 16V  [CAP0402]
C263  100pF, 50V  [CAP0402]
C264  100pF, 50V  [CAP0402]
C265  100pF, 50V  [CAP0402]
C266  100pF, 50V  [CAP0402]
C267  2.2uF, 16V  [CAP0402]
C268  100nF, 16V  [CAP0402]
C269  100pF, 50V  [CAP0402]
ESD21  ESD8472  Assembly Info: NF  [ESD8472_X3DFN2]
ESD22  ESD8472  Assembly Info: NF  [ESD8472_X3DFN2]
ESD23  ESD8472  Assembly Info: NF  [ESD8472_X3DFN2]
ESD24  ESD8472  Assembly Info: NF  [ESD8472_X3DFN2]
ESD25  ESD8472  Assembly Info: NF  [ESD8472_X3DFN2]
FR71  600R, 2A  [RES0805]
FR72  600R, 2A  [RES0805]
FR73  600R, 2A  [RES0805]
FR74  600R, 2A  [RES0805]
IC18  MAX11108AVB  [MAX11108AVB+T]
IC19  ADL5519  [ADL5519_32LFCSP]  (parts A,B of 2)
IC20  MAX11108AVB  [MAX11108AVB+T]
IC21  LMK00101  [LMK00101_WQFN32]
IC22  PE42442  [PE42442_24QFN]
J21  U.FL/MMCX  [MMCX_UFL_conn_U]
J22  U.FL/MMCX  [MMCX_UFL_conn_U]
J23  U.FL/MMCX  [MMCX_UFL_conn_U]
J24  U.FL/MMCX  [MMCX_UFL_conn_U]
J25  U.FL/MMCX  [MMCX_UFL_conn_U]
R89  0R  [RES0402]
R90  10k, 1%  [RES0402]
R91  8.2k, 1%  [RES0402]
R92  0R  [RES0402]
R93  0R  Assembly Info: NF  [RES0402]
R94  0R  [RES0402]
R95  0R  [RES0402]
R96  0R  [RES0402]
R97  0R  [RES0402]
R98  6.2k, 1%  [RES0402]
R99  7.5k, 1%  [RES0402]
R100  0R  [RES0402]
R101  0R  Assembly Info: NF  [RES0402]
R102  0R  [RES0402]
R103  10k, 1%  [RES0402]
R104  8.2k, 1%  [RES0402]
R105  10k, 1%  [RES0402]
R106  10k, 1%  [RES0402]
R107  10k, 1%  [RES0402]
R108  0R  [RES0402]
R109  49.9R, 1%  [RES0402]
R110  0R  [RES0402]
R111  10k, 1%  [RES0402]
R112  10k, 1%  [RES0402]
R113  10k, 1%  [RES0402]

### Nets
+1.5V_DIG_LMK3: C261.2 C262.2 C263.2 C264.2 C265.2 C266.2 FR73.2 IC21.2(Vddo) IC21.6(Vddo) IC21.19(Vddo) IC21.23(Vddo)
+3.3V_DIG_LMK3: C267.2 C268.2 C269.2 FR74.2 IC21.10(Vdd) R110.1
GND: C225.1 C226.1 C227.2 C228.2 C229.1 C230.1 C231.2 C232.1 C233.2 C234.1 C235.1 C236.1 C237.1 C238.1 C239.2 C240.2 C241.1 C242.1 C243.1 C244.2 C245.1 C246.2 C247.1 C248.2 C251.1 C257.1 C258.1 C259.1 C260.1 C261.1 C262.1 C263.1 C264.1 C265.1 C266.1 C267.1 C268.1 C269.1 ESD21.2 ESD22.2 ESD23.2 ESD24.2 ESD25.2 IC18.2(AGND) IC18.5(AGND) IC18.10(AGND) IC19.1(COMR) IC19.2(COMR) IC19.23(COMR) IC19.24(COMR) IC19.27(COMR) IC19.29(COMR) IC19.30(COMR) IC19.PAD IC20.2(AGND) IC20.5(AGND) IC20.10(AGND) IC21.4(GND) IC21.9(GND) IC21.15(GND) IC21.16(GND) IC21.21(GND) IC21.25(GND) IC21.26(GND) IC21.29(SEL1) IC21.30(SEL0) IC21.32(GND) IC22.1(GND) IC22.2(GND) IC22.3(GND) IC22.4(GND) IC22.6(GND) IC22.7(GND) IC22.9(GND) IC22.10(GND) IC22.12(GND) IC22.13(GND) IC22.15(GND) IC22.20(VSSext) IC22.21(GND) IC22.23(GND) IC22.24(GND) IC22.PAD J21.2(Y) J22.2(Y) J23.2(Y) J24.2(Y) J25.2(Y) R91.1 R93.1 R101.1 R104.1 R105.1 R106.2 R107.2 R108.2 R109.1
VCC1P5: C230.2 C231.1 C245.2 C246.1 FR73.1 IC18.7(OVDD) IC20.7(OVDD)
VCC1P8: R111.1 R112.1 R113.1
VCC3P3: C232.2 C233.1 C247.2 C248.1 FR72.1 IC18.4(VDD) IC20.4(VDD)
VCC3P3_CLK: FR74.1 R90.2 R103.2
VCC3P3_RF: C257.2 C258.2 C259.2 C260.2 FR72.2 IC22.16(VDD)
VCC5P0: FR71.1
ADL1_ADJA: IC19.21(ADJA) R99.1 R106.1
ADL1_ADJB: IC19.4(ADJB) R98.1 R105.2
ADL1_VREF: C239.1 IC19.5(VREF) R98.2 R99.2
FPGA_SPI2_LMS1_RX1_I_MISO: IC18.8(DOUT)
FPGA_SPI2_LMS1_RX1_I_SCLK: IC18.9(SCLK) IC21.1(CLKout0)
FPGA_SPI2_LMS1_RX1_Q_MISO: IC20.8(DOUT)
FPGA_SPI2_LMS1_RX1_Q_SCLK: IC20.9(SCLK) IC21.3(CLKout1)
FPGA_SPI2_LMS2_RX1_I_SCLK: IC21.8(CLKout4)
FPGA_SPI2_LMS2_RX1_Q_SCLK: IC21.7(CLKout3)
FPGA_SPI2_LMS2_RX2_I_SCLK: IC21.5(CLKout2)
FPGA_SPI2_LMS2_RX2_Q_SCLK: IC21.17(CLKout5)
FPGA_SPI2_LMS_RX_DET_SS: IC18.6(~{CS}) IC20.6(~{CS})
FPGA_SPI2_SCLK: C249.2
LMS1_RX1_BB_I_DET: IC19.15(OUTA) R89.2 R92.1 R93.2
LMS1_RX1_BB_I_DET_N: IC19.26(INLA) R95.1
LMS1_RX1_BB_I_DET_P: IC19.25(INHA) R94.1
LMS1_RX1_BB_I_N: R95.2
LMS1_RX1_BB_I_P: R94.2
LMS1_RX1_BB_Q_DET: IC19.10(OUTB) R100.1 R101.2 R102.2
LMS1_RX1_BB_Q_DET_N: IC19.31(INLB) R97.1
LMS1_RX1_BB_Q_DET_P: IC19.32(INHB) R96.1
LMS1_RX1_BB_Q_N: R97.2
LMS1_RX1_BB_Q_P: R96.2
RF_SW_V1: IC22.17(V1) R113.2
RF_SW_V2: IC22.18(V2) R112.2
RF_SW_V3: IC22.19(V3) R111.2
NetC225_2: C225.2 IC18.1(AIN) R89.1
NetC226_2: C226.2 C227.1 IC18.3(REF) R90.1 R91.2
NetC228_1: C228.1 IC19.18(CLPA)
NetC229_2: C229.2 C234.2 C235.2 C237.2 C238.2 C241.2 C242.2 FR71.2 IC19.3(VPSB) IC19.20(VPSR) IC19.22(VPSA)
NetC236_2: C236.2 IC20.1(AIN) R102.1
NetC240_1: C240.1 IC19.7(CLPB)
NetC243_2: C243.2 C244.1 IC20.3(REF) R103.1 R104.2
NetC249_1: C249.1 C250.2 R109.2
NetC250_1: C250.1 IC21.13(CLKin0)
NetC251_2: C251.2 IC21.14(CLKin0*)
NetC252_1: C252.1 ESD25.1 J21.1(X)
NetC252_2: C252.2 IC22.22(RFC)
NetC253_1: C253.1 IC22.14(RF1)
NetC253_2: C253.2 ESD24.1 J25.1(X)
NetC254_1: C254.1 IC22.11(RF2)
NetC254_2: C254.2 ESD23.1 J24.1(X)
NetC255_1: C255.1 IC22.8(RF3)
NetC255_2: C255.2 ESD22.1 J23.1(X)
NetC256_1: C256.1 IC22.5(RF4)
NetC256_2: C256.2 ESD21.1 J22.1(X)
NetIC19_6: IC19.6(VLVL) R107.1
NetIC19_8: IC19.8(VSTB) R100.2
NetIC19_11: IC19.11(FBKB) IC19.12(OUTN)
NetIC19_13: IC19.13(OUTP) IC19.14(FBKA)
NetIC19_17: IC19.17(VSTA) R92.2
NetIC19_28: IC19.28(PWDN) R108.1
NetIC21_31: IC21.31(OE) R110.2

Not connected (* = marked no-connect by the designer): IC19 9(NC)* 16(NC)* 19(TEMP)*; IC21 11(OSCin)* 12(OSCout)* 18(CLKout6)* 20(CLKout7)* 22(CLKout8)* 24(CLKout9)* 27(CLKin1*)* 28(CLKin1)*

### Layout directives
differential pair: LMS1_RX1_BB_I_DET_N, LMS1_RX1_BB_I_DET_P, LMS1_RX1_BB_Q_DET_N, LMS1_RX1_BB_Q_DET_P
net class RF_SW_CTRL: RF_SW_V1, RF_SW_V2, RF_SW_V3
net class CLK_PATH: NetC249_1
net class +1.5V_DIG_LMK: +1.5V_DIG_LMK3
net class +3.3V_DIG_LMK3: (no net found under the mark)

### Notes on the sheet
- NF elements on sheet: C225, R93, C236, R101, ESD21, ESD22, ESD23, ESD24, ESD25
- Number of NF elements on sheet: 9
- Log Detector
- LMS1_RX1_BB
- (near C225) ADC
- (near C225) NF
- (near R93) NF
- Vref=1.48V
- ADJA=0.65V
- V=1.15V, I=3mA
- (near R101) NF
- (near C236) NF
- ADJB=0.70V
- RSSI ADC SCLK buffer
- RF SW
- (near J21) RFC
- (near ESD21) NF
- (near ESD22) NF
- (near ESD23) NF
- (near ESD24) NF
- (near ESD25) NF
- RF4
- RF3
- (near J24) RF2
- (near J25) RF1
- Configure as OD
- PCB note: Place 100pF close to each Vdd pin.
- PCB note: Place 100pF close to each Vddo pin.
- Project name:
- Title:
- Size:
- Date:
- A3
- Revision:
- Time:
- Sheet
- of
- File:

### Library data of the parts
C225 C235 C236 C238 C242 C258 C263-C266 C269 = Cap_0402: Manufacturer Part Number 1: CC0402JRNPO9BN101; Manufacturer: Yageo; Part Description: 100pF ±5% 50V C0G, NP0 Ceramic Capacitor -55°C ~ 125°C Surface Mount, MLCC 0402 (1005 Metric) 0.039" L x 0.020" W (1.00mm x 0.50mm); Temperature Coefficient: C0G, NP0; Tolerance: ±5%; Value: 100pF, 50V; Supplier 1: Digi-Key; Supplier Part Number 1: 311-1024-1-ND; RoHS: RoHS Compliant; Category: Capacitors; Applications: General Purpose; Mounting Type: Surface Mount, MLCC; Capacitance: 100pF; Ratings: -; Packaging: Cut Tape (CT); Voltage - Rated: 50V; Size / Dimension: 0.039" L x 0.020" W (1.00mm x 0.50mm); Height - Seated (Max): -; Package / Case: 0402 (1005 Metric); Operating Temperature: -55°C ~ 125°C; Features: -; Lead Spacing: -; Lead Style: -; Thickness (Max): 0.022" (0.55mm)
C226 C230 C232 C243 C245 C247 = Cap_0603: Manufacturer Part Number 1: CC0603MRX5R5BB106; Part Description: 10µF ±20% 6.3V Ceramic Capacitor X5R 0603 (1608 Metric); Manufacturer: Yageo; Capacitance: 10µF; Tolerance: ±20%; Supplier 1: Digi-Key; Supplier Part Number 1: 311-1448-2-ND; Package / Case: 0603 (1608 Metric); Category: Capacitors; Voltage - Rated: 6.3V; Value: 10uF, 6.3V
C227 C231 C233 C234 C237 C239 C241 C244 C246 C248-C251 C260 C262 C268 = Cap_0402: as C177-C180 on sheet 09_RF_Loopback; Value: 100nF, 16V; Supplier 1: Mouser; Supplier Part Number 1: 81-GRM155R71C104KA88; Case Code - in: 0402; RoHS: RoHS Compliant; Operating Temperature Range: - 55 C to + 125 C; Series: GRM; Termination Style: SMD/SMT; Package / Case: 0402 (1005 metric); Voltage Rating DC: 16 V; Maximum Operating Temperature: + 125 C; Case Code - mm: 1005; Minimum Operating Temperature: - 55 C; Product Category: Low & Medium Capacitance SMD Ceramic Chip Capacitors; Packaging: Reel; Product: General Type MLCCs; Category: Multilayer Ceramic Capacitors MLCC - SMD/SMT; Brand: Murata Electronics; Case Width: 0.5 mm; RoHS - Mouser: Y; Standard Pack Qty: 10000; Minimum Order Quantity: 1; Reeling: True; Manufacturer Part Number 1: GRM155R71C104KA88D
C228 C240 = Cap_0402: Manufacturer Part Number 1: 04023A100JAT2A; Manufacturer: AVX; Part Description: 10pF ±5% 25V Ceramic Capacitor C0G, NP0 0402 (1005 Metric); Capacitance Tolerance: ± 5%; Voltage Rating: 25; Ceramic Capacitor Case: 0402 [1005 Metric]; Capacitor Case Style: 0402 [1005 Metric]<!--FANDB--><div class="features-and-benefits-container"></div>; Dielectric Characteristic: C0G / NP0; SVHC: No SVHC (16-Jun-2014); Capacitance: 10; Value: 10pF, 25V; Supplier 1: Farnell; Supplier Part Number 1: 2332478RL; Product Range: -; RoHS: YES; Operating Temperature Min: -55; Operating Temperature Max: 125; Capacitance Tolerance ±: ± 5%; MSL: MSL 1 - Unlimited; Packaging: Cut Tape
C229 = Cap_0603: Manufacturer: Yageo; Manufacturer Part Number 1: GRM188R61C106MA73D; Part Description: 10µF ±20% 16V Ceramic Capacitor X5R 0603 (1608 Metric); Temperature Coefficient: X5R; Capacitance: 10µF; Tolerance: ±20%; Value: 10uF, 16V; Supplier 1: Digi-Key; Supplier Part Number 1: 490-7201-2-ND; Category: Capacitors; Ratings: -; Features: -; Lead Style: -; Package / Case: 0603 (1608 Metric); Lead Spacing: -; Applications: General Purpose; Voltage - Rated: 16V; Operating Temperature: -55°C ~ 85°C; Thickness (Max): 0.039" (1.00mm); Mounting Type: Surface Mount, MLCC; RoHS: RoHS Compliant; Size / Dimension: 0.063" L x 0.031" W (1.60mm x 0.80mm); Packaging: Tape & Reel (TR); Height - Seated (Max): -
C252-C256 = Cap_0402: Manufacturer Part Number: C1005C0G1H471J050BA; Manufacturer: TDK Corporation; Part Description: 470pF ±5% 50V Ceramic Capacitor C0G, NP0 0402 (1005 Metric); Tolerance: ±5%; Temperature Coefficient: C0G, NP0; Value: 470pF, 50V; Supplier 1: Digi-Key; Supplier Part Number 1: 445-2656-6-ND; Ratings: -; Package / Case: 0402 (1005 Metric); Capacitance: 470pF; Packaging: Digi-Reel®; RoHS: RoHS Compliant; Lead Style: -; Thickness (Max): 0.022" (0.55mm); Size / Dimension: 0.039" L x 0.020" W (1.00mm x 0.50mm); Lead Spacing: -; Operating Temperature: -55°C ~ 125°C; Height - Seated (Max): -; Applications: General Purpose; Mounting Type: Surface Mount, MLCC; Voltage - Rated: 50V; Category: Capacitors; Features: -
C257 = Cap_0603: Manufacturer: TDK; Manufacturer Part Number 1: GRM155R61A105KE15J; Part Description: 1µF ±10% 10V Ceramic Capacitor X5R 0402 (1005 Metric); Capacitance: 1; Capacitance Tolerance: ± 10%; Ceramic Capacitor Case: 0402 [1005 Metric]; Dielectric Characteristic: X6; Product Range: TDK - C Series; Voltage Rating: 10; Supplier 1: Newark; Supplier Part Number 1: 490-6298-2-ND; Value: 1uF, 10V; MSL: -; RoHS: YES
C259 = Cap_0603: Manufacturer Part Number 1: C1608X5R1A226M080AC; Part Description: 22µF ±20% 10V Ceramic Capacitor X5R 0603 (1608 Metric); Manufacturer: TDK Corporation; Brand: TDK; Temperature Coefficient / Code: +/- 15 %; Tolerance: 20 %; Type: Multilayer Ceramic Chip Capacitor; Supplier 1: Mouser; Supplier Part Number 1: 810-C1608X5R1A226M; Package / Case: 0603 (1608 metric); Category: Multilayer Ceramic Capacitors MLCC - SMD/SMT; Capacitance: 22 uF; Operating Temperature Range: - 55 C to + 85 C; Case Code - in: 0603; Voltage Rating DC: 10 V; Case Code - mm: 1608; Value: 22uF, 10V
C261 C267 = Cap_0402: CAP CER 2.2UF 16V 10% X5R 0402; Manufacturer Part Number 1: C1005X5R1C225K050BC; Manufacturer: TDK Corporation; Part Description: 2.2µF ±10% 16V Ceramic Capacitor X5R 0402 (1005 Metric); Capacitance: 2.2µF; Tolerance: ±20%; Capacitor Case Style: 0402 [1005 Metric]; Value: 2.2uF, 16V; Supplier 1: Digi-Key; Supplier Part Number 1: 445-9085-6-ND; Category: Capacitors; Voltage - Rated: 16V; Thickness (Max): 0.022" (0.55mm); Applications: General Purpose; Package / Case: 0402 (1005 Metric); Size / Dimension: 0.039" L x 0.020" W (1.00mm x 0.50mm); Features: -; Temperature Coefficient: X5R; Mounting Type: Surface Mount, MLCC; Ratings: -; Lead Style: -; Operating Temperature: -55°C ~ 85°C; Lead Spacing: -; RoHS: RoHS Compliant; Height - Seated (Max): -; Packaging: Tape & Reel (TR); Operating Temperature Range: -55°C to +85
ESD21-ESD25 = ESD8472: as ESD13-ESD20 on sheet 09_RF_Loopback; Supplier 1: Digi-Key; RoHS: RoHS Compliant; Category: Circuit Protection; Stock 1: 2295; Pricing 1: 1=0.39, 10=0.315, 100=0.2142, 500=0.16068, 1000=0.12051 (USD); Packaging: Cut Tape (CT); Part Status: Active; Type: Zener; Power - Peak Pulse: -; Applications: Automotive, RF Antenna; Operating Temperature: -55°C ~ 150°C (TJ); Mounting Type: Surface Mount; Package / Case: 2-XFDFN; Supplier Device Package: 2-X3DFN (0.62x0.32); ComponentLink1URL: http://www.onsemi.com/pub/Collateral/ESD8472-D.PDF; ComponentLink1Description: http://www.onsemi.com/pub/Collateral/ESD8472-D.PDF; Supplier Part Number 1: ESD8472MUT5GOSCT-ND
FR71 FR73 FR74 = Ferrite: Manufacturer Part Number 1: MPZ2012S601A; Manufacturer: TDK; Part Description: FERRITE BEAD 600 OHM 0805 1LN; Filter Type: Differential Mode - Single; Impedance @ Frequency: 600 Ohm @ 100MHz; DC Resistance (DCR): 100 mOhm Max; DC Current Rating: 2; DC Resistance Max: 0.1; Ferrite Case Style: 0805 [2012 Metric]; Ferrite Mounting: SMD; Impedance @ 100MHz: 600; Impedance Tolerance: ± 25%; Supplier 1: Farnell; Supplier Part Number 1: 1669753RL; Mounting Type: Surface Mount; RoHS: RoHS Compliant; Height (Max): 0.041" (1.05mm); Packaging: Tape & Reel (TR); Category: Filters; Current Rating: 2A; Package / Case: 0805 (2012 Metric); Size / Dimension: 0.079" L x 0.049" W (2.00mm x 1.25mm); Value: 600R, 2A; Core Material: Ferrite; Supplier: Farnell
FR72 = Ferrite: Manufacturer Part Number 1: MPZ2012S601A; Manufacturer: TDK; Part Description: FERRITE BEAD 600 OHM 0805 1LN; Impedance Tolerance: ± 25%; Impedance @ 100MHz: 600; Ferrite Mounting: SMD; DC Resistance Max: 0.1; DC Current Rating: 2; Ferrite Case Style: 0805 [2012 Metric]; DC Resistance (DCR): 100 mOhm Max; Filter Type: Differential Mode - Single; Impedance @ Frequency: 600 Ohm @ 100MHz; Supplier 1: Farnell; Supplier Part Number 1: 1669753RL; Supplier: Farnell; Core Material: Ferrite; Value: 600R, 2A; Category: Filters; Current Rating: 2A; Height (Max): 0.041" (1.05mm); Mounting Type: Surface Mount; Package / Case: 0805 (2012 Metric); Packaging: Tape & Reel (TR); RoHS: RoHS Compliant; Size / Dimension: 0.079" L x 0.049" W (2.00mm x 1.25mm)
IC18 IC20 = MAX11108AVB+T: Part Description: 12 Bit Analog to Digital Converter 1 Input 1 SAR 10-UTQFN (2.1x1.6); Manufacturer: Maxim Integrated; Number of Bits: 12; Sampling Rate (Per Second): 3M; Number of Inputs: 1; Input Type: Single Ended; Data Interface: SPI; Configuration: S/H-ADC; Ratio - S/H:ADC: 1:1; Architecture: SAR; Reference Type: External; Voltage - Supply, Analog: 2.2 V ~ 3.6 V; Supplier 1: Digi-Key; Manufacturer Part Number 1: MAX11108AVB+T; RoHS: RoHS Compliant; Category: Integrated Circuits (ICs); Stock 1: 4253; Pricing 1: 1=4.05, 10=3.825, 25=3.06, 50=2.907, 100=2.6775, 250=2.5398, 500=2.44802 (USD); Packaging: Cut Tape (CT); Part Status: Active; Number of A/D Converters: 1; Voltage - Supply, Digital: 2.2 V ~ 3.6 V; Features: -; Operating Temperature: -40°C ~ 125°C; Package / Case: 10-UFQFN; Supplier Device Package: 10-UTQFN (2.1x1.6); ComponentLink1URL: http://datasheets.maximintegrated.com/en/ds/MAX11108.pdf; ComponentLink1Description: http://datasheets.maximintegrated.com/en/ds/MAX11108.pdf; Supplier Part Number 1: MAX11108AVB+TCT-ND
IC19 = ADL5519: Manufacturer: Analog Devices Inc.; Manufacturer Part Number 1: ADL5519ACPZ-R7; Part Description: RF IC Detector/Controller WiMax, WLAN 1MHz ~ 10GHz 32-LFCSP-VQ (5x5); Function: Detector/Controller; Frequency: 1MHz ~ 10GHz; RF Type: WiMax, WLAN; Supplier 1: Digi-Key; RoHS: RoHS Compliant; Category: RF/IF and RFID; Stock 1: 993; Pricing 1: 1=11.11, 10=10.214, 100=8.626, 500=7.6734 (USD); Packaging: Cut Tape (CT); Part Status: Active; Secondary Attributes: -; Package / Case: 32-VFQFN Exposed Pad, CSP; Supplier Device Package: 32-LFCSP-VQ (5x5); ComponentLink1URL: http://www.analog.com/media/en/technical-documentation/data-sheets/ADL5519.pdf; ComponentLink1Description: http://www.analog.com/media/en/technical-documentation/data-sheets/ADL5519.pdf; Supplier Part Number 1: ADL5519ACPZ-R7CT-ND
IC21 = LMK00101: Manufacturer: Texas Instruments; Manufacturer Part Number 1: LMK00101SQE/NOPB; Part Description: Clock Fanout Buffer (Distribution), Multiplexer, Translator IC 200MHz 32-WFQFN Exposed Pad; Input: HCSL, LVCMOS, LVDS, LVPECL, LVTTL, SSTL, Crystal; Frequency - Max: 200MHz; Output: LVCMOS, LVTTL; Ratio - Input:Output: 3:10; Number of Circuits: 1; Voltage - Supply: 2.375 V ~ 3.45 V; Differential - Input:Output: Yes/No; Supplier 1: Digi-Key; Mounting Type: Surface Mount; Package / Case: 32-WFQFN Exposed Pad; RoHS: RoHS Compliant; Operating Temperature: -40°C ~ 85°C; Type: Fanout Buffer (Distribution), Multiplexer, Translator; Category: Integrated Circuits (ICs); Packaging: Cut Tape (CT); Supplier Device Package: 32-WQFN (5x5); Supplier Part Number 1: 296-39036-1-ND
IC22 = PE42442: UltraCMOS SPDT RF Switch  100 – 6000 MHz; Manufacturer Part Number 1: PE42442A-Z; Manufacturer: Peregrine Semiconductor; Part Description: RF Switch IC 3G/4G SP4T 6GHz 50 Ohm 24-QFN (4x4); Topology: Absorptive; Insertion Loss @ Frequency: 1.1dB @ 900MHz; IIP3: 58dBm (typ); Isolation @ Frequency: 61dB @ 900MHz (typ); RF Type: 3G/4G; Voltage - Supply: 3.3V; Impedance: 50 Ohm; Circuit: SP4T; Frequency - Lower: 30MHz; Frequency - Upper: 6GHz; Supplier 1: Digi-Key; Supplier Device Package: 24-QFN (4x4); Package / Case: 24-WFQFN Exposed Pad; Operating Temperature: -40°C ~ 105°C; Features: -; P1dB: -; Category: RF/IF and RFID; Packaging: Cut Tape (CT); RoHS: RoHS Compliant; Supplier Part Number 1: 1046-1096-1-ND
J21-J25 = RF_IF_connector: as J13-J20 on sheet 09_RF_Loopback; Cable Group: -; Category: Connectors, Interconnects; Fastening Type: Snap-On; Features: -; Housing Color: Silver; Ingress Protection: -; Mounting Type: Surface Mount; Operating Temperature: -40°C ~ 90°C; Packaging: Cut Tape (CT); RoHS: RoHS Compliant; Shield Termination: Solder; Supplier 1: Digi-Key; Supplier Part Number 1: WM5587CT-ND
R89 R92-R97 R100-R102 R108 R110 = Res_0402: Manufacturer Part Number 1: RC0402JR-070RL; Manufacturer: Yageo; Part Description: RES SMD 0.0OHM JUMPER 1/16W 0402; Resistance (Ohms): 0.0; Tolerance: Jumper; Power (Watts): 0.063W, 1/16W; Value: 0R; Supplier 1: Digi-Key; Supplier Part Number 1: 311-0.0JRTR-ND; Category: Resistors; Temperature Coefficient: -; Features: Moisture Resistant; Supplier Device Package: 0402; Height: 0.016" (0.40mm); Package / Case: 0402 (1005 Metric); Operating Temperature: -55°C ~ 155°C; Size / Dimension: 0.039" L x 0.020" W (1.00mm x 0.50mm); Composition: Thick Film; Packaging: Tape & Reel (TR); Number of Terminations: 2; RoHS: RoHS Compliant
R90 R103 R105-R107 R111-R113 = Res_0402: Manufacturer: Yageo; Manufacturer Part Number 1: RC0402FR-0710KL; Part Description: RES SMD 10K OHM 1% 1/16W 0402; Temperature Coefficient: ±100ppm/°C; Power (Watts): 0.063W, 1/16W; Value: 10k, 1%; Supplier 1: Digi-Key; Supplier Part Number 1: 311-10.0KLRTR-ND; Resistance (Ohms): 10k; Packaging: Tape & Reel (TR); RoHS: RoHS Compliant; Package / Case: 0402 (1005 Metric); Tolerance: ±1%; Operating Temperature: -55°C ~ 155°C; Size / Dimension: 0.039" L x 0.020" W (1.00mm x 0.50mm); Number of Terminations: 2; Category: Resistors; Height: 0.016" (0.40mm); Supplier Device Package: 0402; Features: Moisture Resistant; Composition: Thick Film
R91 R104 = Res_0402: Manufacturer: Yageo; Part Description: RES SMD 8.2K OHM 1% 1/16W 0402; Manufacturer Part Number 1: RC0402FR-078K2L; Power (Watts): 0.063W, 1/16W; Temperature Coefficient: ±100ppm/°C; Value: 8.2k, 1%; Supplier 1: Digi-Key; Supplier Device Package: 0402; Package / Case: 0402 (1005 Metric); Height: 0.016" (0.40mm); Supplier Part Number 1: 311-8.20KLRCT-ND; Number of Terminations: 2; Operating Temperature: -55°C ~ 155°C; Resistance (Ohms): 8.2k; Size / Dimension: 0.039" L x 0.020" W (1.00mm x 0.50mm); Composition: Thick Film; Category: Resistors; Tolerance: ±1%; Features: Moisture Resistant; RoHS: RoHS Compliant; Packaging: Cut Tape (CT)
R98 = Res_0402: Manufacturer: Yageo; Manufacturer Part Number: RC0402FR-076K2L; Part Description: ±1% 0.063W, 1/16W Chip Resistor 0402 (1005 Metric) Moisture Resistant Thick Film; Temperature Coefficient: ±100ppm/°C; Power (Watts): 0.063W, 1/16W; Value: 6.2k, 1%; Supplier Device Package: 0402; Package / Case: 0402 (1005 Metric); Failure Rate: -; Operating Temperature: -55°C ~ 155°C; Height - Seated (Max): 0.016" (0.40mm); Tolerance: ±1%; Category: Resistors; Part Status: Active; Packaging: Cut Tape (CT); RoHS: RoHS Compliant; Size / Dimension: 0.039" L x 0.020" W (1.00mm x 0.50mm); Supplier 1: Digi-Key; Supplier Part Number 1: 311-6.20KLRCT-ND; Features: Moisture Resistant; Composition: Thick Film
R99 = Res_0402: Manufacturer Part Number: RC0402FR-077K5L; Manufacturer: Yageo; Part Description: ±1% 0.063W, 1/16W Chip Resistor 0402 (1005 Metric) Automotive AEC-Q200, Moisture Resistant Thick Film; Power (Watts): 0.063W, 1/16W; Temperature Coefficient: ±100ppm/°C; Value: 7.5k, 1%; Packaging: Cut Tape (CT); Tolerance: ±1%; RoHS: RoHS Compliant; Supplier Device Package: 0402; Size / Dimension: 0.039" L x 0.020" W (1.00mm x 0.50mm); Category: Resistors; Failure Rate: -; Supplier 1: Digi-Key; Composition: Thick Film; Package / Case: 0402 (1005 Metric); Supplier Part Number 1: YAG3512CT-ND; Features: Automotive AEC-Q200, Moisture Resistant; Height - Seated (Max): 0.015" (0.37mm); Part Status: Active; Operating Temperature: -55°C ~ 155°C
R109 = Res_0402: Manufacturer: Samsung Electro-Mechanics America, Inc.; Part Description: RES SMD 49.9 OHM 1% 1/16W 0402; Manufacturer Part Number 1: RC1005F49R9CS; Temperature Coefficient: ±100ppm/°C; Resistance (Ohms): 49.9; Power (Watts): 0.063W, 1/16W; Number of Terminations: 2; Size / Dimension: 0.039" L x 0.020" W (1.00mm x 0.50mm); Supplier Device Package: 0402 (1005 Metric); RoHS: RoHS Compliant; Supplier Part Number 1: 1276-3469-6-ND; Features: -; Packaging: Digi-Reel®; Tolerance: ±1%; Height: 0.016" (0.40mm); Category: Resistors; Composition: Thick Film; Package / Case: 0402 (1005 Metric); Supplier 1: Digi-Key; Operating Temperature: -55°C ~ 155°C; Value: 49.9R, 1%